# Altium schematic sheet BOOST.SchDoc
size A
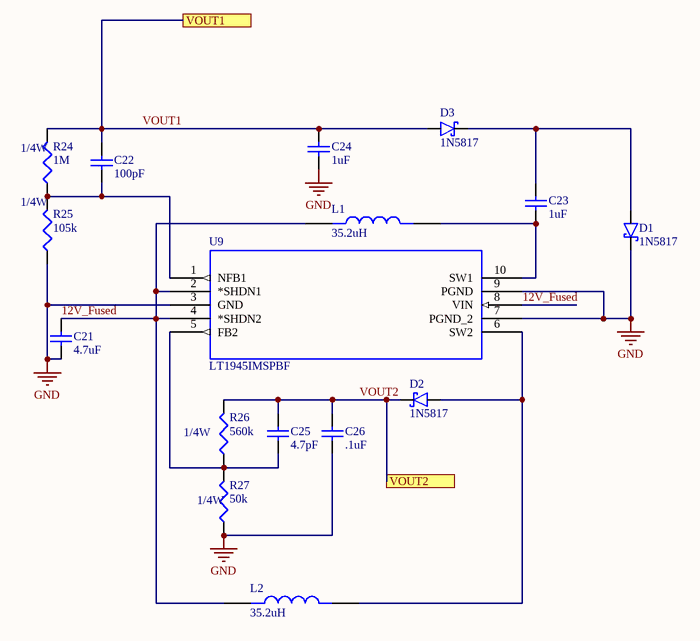
[diagram p0: BOOST.SchDoc]

## Parts
C21  4.7uF  [Cap, 5mm TH, Ceramic]
C22  100pF  [Cap, 5mm TH, Ceramic]
C23  1uF  [Cap, 5mm TH, Ceramic]
C24  1uF  [Cap, 5mm TH, Ceramic]
C25  4.7pF  [Cap, 5mm TH, Ceramic]
C26  .1uF  [Cap, 5mm TH, Ceramic]
D1  1N5817  [Diode, TH]
D2  1N5817  [Diode, TH]
D3  1N5817  [Diode, TH]
L1  35.2uH  [IND_LQH5BPB220MT0L]
L2  35.2uH  [IND_LQH5BPB220MT0L]
R24  1M  [RESAD640W45L370D200 - duplicate]
R25  105k  [RESAD640W45L370D200 - duplicate]
R26  560k  [RESAD640W45L370D200 - duplicate]
R27  50k  [RESAD640W45L370D200 - duplicate]
U9  LT1945IMSPBF  [MSOP-10_MS]

## Ports
VOUT1, VOUT2

## Nets
GND: C21.1(Pos) C24.1(Pos) C26.1(Pos) D1.2 R25.1 R27.1 U9.3(GND) U9.7(PGND_2) U9.9(PGND)
12V_Fused: C21.2(Neg) L1.1 L2.1 U9.2(*SHDN1) U9.4(*SHDN2) U9.8(VIN)
VOUT1: C22.2(Neg) C24.2(Neg) D3.1 R24.2 ; port VOUT1
VOUT2: C25.2(Neg) C26.2(Neg) D2.2 R26.2 ; port VOUT2
NetC22_1: C22.1(Pos) R24.1 R25.2 U9.1(NFB1)
NetC23_1: C23.1(Pos) L1.2 U9.10(SW1)
NetC23_2: C23.2(Neg) D1.1 D3.2
NetC25_1: C25.1(Pos) R26.1 R27.2 U9.5(FB2)
NetD2_1: D2.1 L2.2 U9.6(SW2)

## Notes on the sheet
- (near R24) 1/4W
- (near R25) 1/4W
- (near R26) 1/4W
- (near R27) 1/4W

## Library data of the parts
C21-C26 = Cap, 5MM TH, Ceramic: Generic Cap, 5MM TH, Ceramic; TargetLibrary: RITRacing-Passives; Value: Value?; Publisher: T.Tallo; Published: 22Oct2016; Status: Active
D1-D3 = 1N5817: 5A SCHOTTKY RECTIFIER; MF: STMicroelectronics; Value: *; SnapEDA_Link: https://www.snapeda.com/parts/1N5817/STMicroelectronics/view-part/2770372/?ref=snap; Price: None; Availability: Unavailable; Package: DO-41 STMicroelectronics; MP: 1N5817
L1 L2 = LQH5BPB220MT0L: 22ÂµH Shielded Wirewound Inductor 1.05A 310.8mOhm Max Nonstandard; MF: Murata; Availability: Warning; Purchase-URL: https://pricing.snapeda.com/search/part/LQH5BPB220MT0L/?ref=eda; SnapEDA_Link: https://www.snapeda.com/parts/LQH5BPB220MT0L/Murata/view-part/4547202/?ref=snap; MP: LQH5BPB220MT0L; Price: None; Package: NONSTANDARD; Value: *
R24-R27 = Resistor, TH: Generic TH Resistor; TargetLibrary: RITRacing-Passives; Value: Value?; Publisher: T.Tallo; Published: 22Oct2016; Status: Active
U9 = LT1945IMSPBF: Boost, SEPIC Switching Regulator IC Positive and Negative (Dual Rail) Adjustable Â±1.23V 2 Output 250mA (Switch) 10-TFSOP, 10-MSOP (0.118, 3.00mm Width); MF: Linear Technology/Analog Devices; MP: LT1945IMS#PBF; Value: *; Package: None; Purchase-URL: https://pricing.snapeda.com/search/part/LT1945IMS#PBF/?ref=eda; Price: None; SnapEDA_Link: https://www.snapeda.com/parts/LT1945IMS%23PBF/Analog%20Devices/view-part/4832995/?ref=snap; Check_prices: https://www.snapeda.com/parts/LT1945IMS%23PBF/Analog%20Devices/view-part/4832995/?ref=eda; Availability: Good